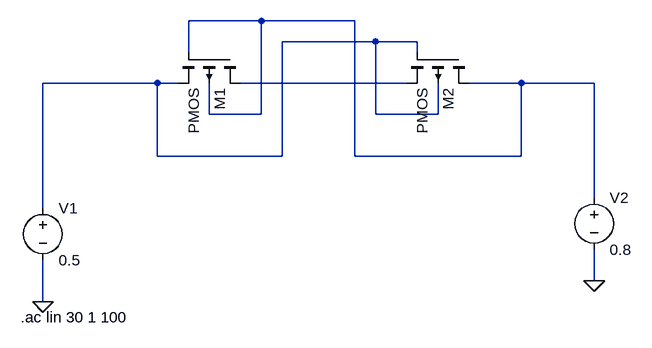
[diagram p0: schematic active_resistor.asc]
active_resistor.asc, the LTspice schematic file:
Version 4
SHEET 1 880 680
WIRE 128 -240 16 -240
WIRE 272 -240 128 -240
WIRE 304 -208 160 -208
WIRE 368 -208 304 -208
WIRE 16 -192 16 -240
WIRE 368 -192 368 -208
WIRE -32 -144 -208 -144
WIRE 0 -144 -32 -144
WIRE 352 -144 96 -144
WIRE 528 -144 448 -144
WIRE 640 -144 528 -144
WIRE 48 -96 48 -144
WIRE 128 -96 128 -240
WIRE 128 -96 48 -96
WIRE 304 -96 304 -208
WIRE 400 -96 400 -144
WIRE 400 -96 304 -96
WIRE -32 -32 -32 -144
WIRE 160 -32 160 -208
WIRE 160 -32 -32 -32
WIRE 272 -32 272 -240
WIRE 528 -32 528 -144
WIRE 528 -32 272 -32
WIRE 640 32 640 -144
WIRE -208 48 -208 -144
WIRE 640 160 640 112
WIRE -208 192 -208 128
FLAG -208 192 0
FLAG 640 160 0
SYMBOL pmos4 96 -192 R90
SYMATTR InstName M1
SYMATTR Value2 l=10u w=20u
SYMBOL pmos4 448 -192 R90
SYMATTR InstName M2
SYMATTR Value2 l=10u w=20u
SYMBOL voltage -208 32 R0
WINDOW 123 0 0 Left 2
WINDOW 39 0 0 Left 2
SYMATTR InstName V1
SYMATTR Value 0.5
SYMBOL voltage 640 16 R0
WINDOW 123 0 0 Left 2
WINDOW 39 0 0 Left 2
SYMATTR InstName V2
SYMATTR Value 0.8
TEXT -242 216 Left 2 !.ac lin 30 1 100

The netlist it stands for:
* active_resistor.asc
M1 N003 N001 N002 N001 PMOS l=10u w=20u
M2 N001 N002 N003 N002 PMOS l=10u w=20u
V1 N002 0 0.5
V2 N001 0 0.8
.model NMOS NMOS
.model PMOS PMOS
.lib standard.mos
.ac lin 30 1 100
.backanno
.end